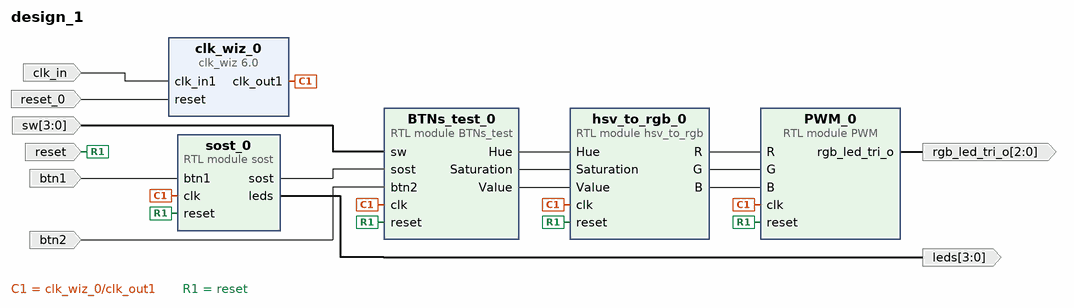
[diagram p0: block diagram of the top level]
# Vivado block design design_1, xc7z010clg400-1, Vivado 2018.2
create_bd_design design_1

create_bd_port -dir I -type clk clk_in
create_bd_port -dir O -from 2 -to 0 rgb_led_tri_o
create_bd_port -dir I -from 3 -to 0 sw
create_bd_port -dir I -type rst reset_0
set_property -dict {CONFIG.POLARITY ACTIVE_HIGH} [get_bd_ports reset_0]
create_bd_port -dir I -type rst reset
set_property -dict {CONFIG.POLARITY ACTIVE_HIGH} [get_bd_ports reset]
create_bd_port -dir I btn2
create_bd_port -dir O -from 3 -to 0 leds
create_bd_port -dir I btn1

create_bd_cell -type ip -vlnv xilinx.com:ip:clk_wiz:6.0 clk_wiz_0
set_property -dict [list \
  CONFIG.CLKOUT2_USED false \
  CONFIG.CLKOUT3_USED false \
  CONFIG.NUM_OUT_CLKS 1 \
  CONFIG.CLKOUT1_REQUESTED_OUT_FREQ 10.000 \
  CONFIG.CLKOUT2_REQUESTED_OUT_FREQ 80.000 \
  CONFIG.CLKOUT3_REQUESTED_OUT_FREQ 160.000 \
  CONFIG.MMCM_DIVCLK_DIVIDE 2 \
  CONFIG.MMCM_CLKFBOUT_MULT_F 15.625 \
  CONFIG.MMCM_CLKOUT0_DIVIDE_F 78.125 \
  CONFIG.MMCM_CLKOUT1_DIVIDE 1 \
  CONFIG.MMCM_CLKOUT2_DIVIDE 1 \
  CONFIG.CLKOUT1_JITTER 290.478 \
  CONFIG.CLKOUT1_PHASE_ERROR 133.882 \
  CONFIG.CLKOUT2_JITTER 260.522 \
  CONFIG.CLKOUT2_PHASE_ERROR 301.601 \
  CONFIG.CLKOUT3_JITTER 235.916 \
  CONFIG.CLKOUT3_PHASE_ERROR 301.601 \
] [get_bd_cells clk_wiz_0]
create_bd_cell -type module -reference PWM PWM_0
create_bd_cell -type module -reference hsv_to_rgb hsv_to_rgb_0
create_bd_cell -type module -reference BTNs_test BTNs_test_0
create_bd_cell -type module -reference sost sost_0

# ---- connections ----

connect_bd_net -net clk_in1_0_1 [get_bd_ports clk_in] [get_bd_pins clk_wiz_0/clk_in1]
connect_bd_net [get_bd_pins hsv_to_rgb_0/R] [get_bd_pins PWM_0/R]
connect_bd_net [get_bd_pins hsv_to_rgb_0/G] [get_bd_pins PWM_0/G]
connect_bd_net [get_bd_pins hsv_to_rgb_0/B] [get_bd_pins PWM_0/B]
connect_bd_net [get_bd_pins PWM_0/rgb_led_tri_o] [get_bd_ports rgb_led_tri_o]
connect_bd_net [get_bd_pins clk_wiz_0/clk_out1] \
  [get_bd_pins hsv_to_rgb_0/clk] [get_bd_pins PWM_0/clk] [get_bd_pins BTNs_test_0/clk] [get_bd_pins sost_0/clk]
connect_bd_net -net sw_0_1 [get_bd_ports sw] [get_bd_pins BTNs_test_0/sw]
connect_bd_net [get_bd_pins BTNs_test_0/Hue] [get_bd_pins hsv_to_rgb_0/Hue]
connect_bd_net [get_bd_pins BTNs_test_0/Saturation] [get_bd_pins hsv_to_rgb_0/Saturation]
connect_bd_net [get_bd_pins BTNs_test_0/Value] [get_bd_pins hsv_to_rgb_0/Value]
connect_bd_net -net reset_0_1 [get_bd_ports reset_0] [get_bd_pins clk_wiz_0/reset]
connect_bd_net -net reset_1_1 [get_bd_ports reset] \
  [get_bd_pins PWM_0/reset] [get_bd_pins hsv_to_rgb_0/reset] [get_bd_pins BTNs_test_0/reset] [get_bd_pins sost_0/reset]
connect_bd_net -net btn2_0_1 [get_bd_ports btn2] [get_bd_pins BTNs_test_0/btn2]
connect_bd_net [get_bd_pins sost_0/leds] [get_bd_ports leds]
connect_bd_net [get_bd_pins sost_0/sost] [get_bd_pins BTNs_test_0/sost]
connect_bd_net -net btn1_0_1 [get_bd_ports btn1] [get_bd_pins sost_0/btn1]

validate_bd_design
save_bd_design
